# EAGLE design stk681ユニバーサル (EAGLE 5.11)
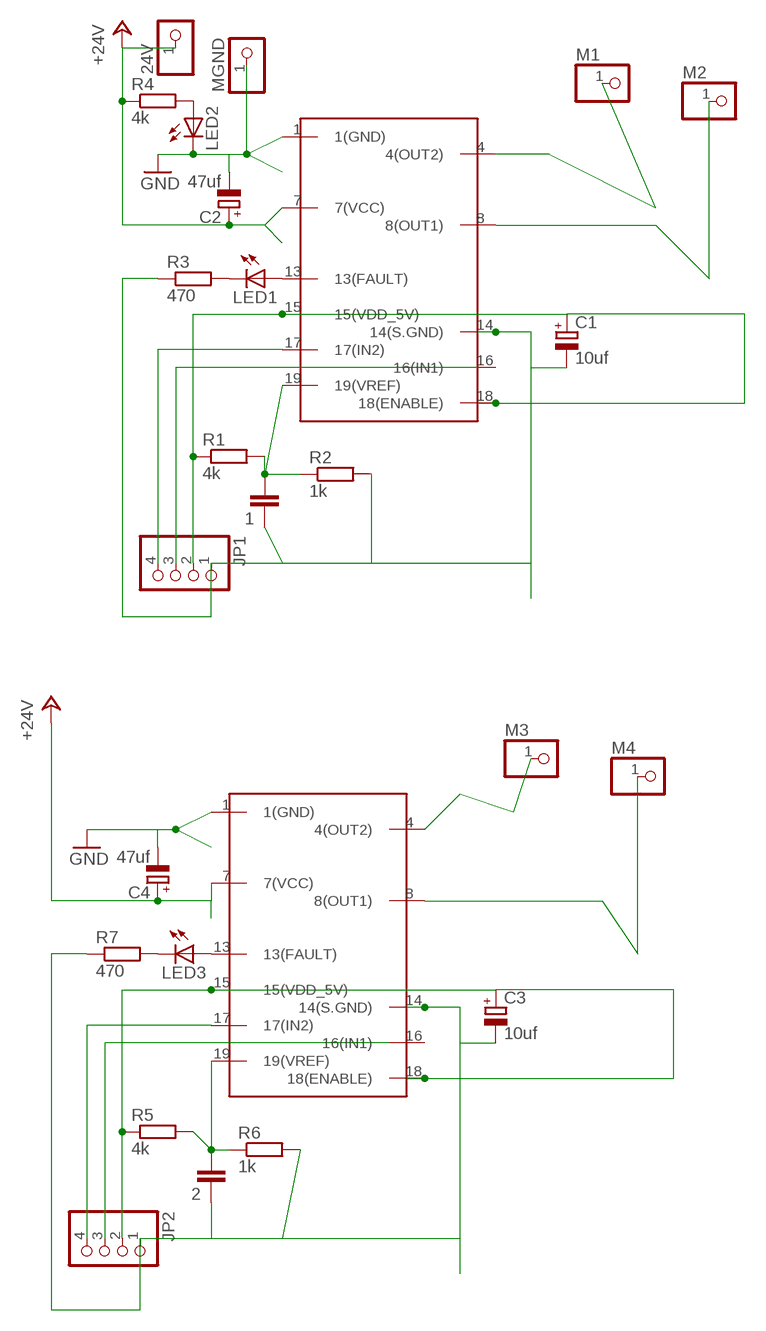
[diagram p0: schematic, sheet 1]

## Parts
1  C2,5-3  [C2.5-3]
2  C2,5-3  [C2.5-3]
24V  PINHD-1X1  [1X01]
C1  10uf  CPOL-EUSANYO_F13  [SANYO-OSCON_F13]
C2  47uf  CPOL-EUSANYO_F13  [SANYO-OSCON_F13]
C3  10uf  CPOL-EUSANYO_F13  [SANYO-OSCON_F13]
C4  47uf  CPOL-EUSANYO_F13  [SANYO-OSCON_F13]
JP1  PINHD-1X4/90  [1X04/90]
JP2  PINHD-1X4/90  [1X04/90]
LED1  LED5MM  [LED5MM]
LED2  LED5MM  [LED5MM]
LED3  LED5MM  [LED5MM]
M1  PINHD-1X1  [1X01]
M2  PINHD-1X1  [1X01]
M3  PINHD-1X1  [1X01]
M4  PINHD-1X1  [1X01]
MGND  PINHD-1X1  [1X01]
R1  4k  R-EU_0204/7  [0204/7]
R2  1k  R-EU_0204/7  [0204/7]
R3  470  R-EU_0204/7  [0204/7]
R4  4k  R-EU_0204/7  [0204/7]
R5  4k  R-EU_0204/7  [0204/7]
R6  1k  R-EU_0204/7  [0204/7]
R7  470  R-EU_0204/7  [0204/7]
U$1  STK-681-332_UNI  [STK681-332_UNI]
U$2  STK-681-332_UNI  [STK681-332_UNI]

## Nets
+24V: 24V.1 C2.+ C4.+ R4.1 U$1.7(7(VCC)) U$2.7(7(VCC))
GND: C2.- C4.- LED2.K(C) MGND.1 U$1.1(1(GND)) U$2.1(1(GND))
M1: M4.1
M2: M2.1
N$1: M1.1
N$2: M3.1
N$3: JP1.3
N$4: JP1.4 U$1.17(17(IN2))
N$5: LED1.A U$1.13(13(FAULT))
N$6: 1.2 R1.2 R2.1 U$1.19(19(VREF))
N$7: LED1.K(C) R3.2
N$8: LED3.A U$2.13(13(FAULT))
N$9: JP2.3
N$10: LED2.A R4.2
N$11: JP2.4 U$2.17(17(IN2))
N$13: 2.2 R5.2 R6.1 U$2.19(19(VREF))
N$14: LED3.K(C) R7.2
N$16: C3.+ JP2.2 R5.1 U$2.15(15(VDD_5V)) U$2.18(18(ENABLE))
N$17: C1.+ JP1.2 R1.1 U$1.15(15(VDD_5V)) U$1.18(18(ENABLE))
N$20: 2.1 C3.- JP2.1 R6.2 R7.1 U$2.14(14(S.GND))
N$21: 1.1 C1.- JP1.1 R2.2 R3.1 U$1.14(14(S.GND))
Unconnected: U$1.4(4(OUT2)) U$1.8(8(OUT1)) U$1.16(16(IN1)) U$2.4(4(OUT2)) U$2.8(8(OUT1)) U$2.16(16(IN1))

## Library data of the parts
1 2 = capacitor-wima:C: CAPACITOR naming: grid - package width
24V M1-M4 MGND = pinhead:PINHD-1X1: PIN HEADER
C1-C4 = rcl:CPOL-EU: POLARIZED CAPACITOR, European symbol
JP1 JP2 = pinhead:PINHD-1X4: PIN HEADER
LED1-LED3 = led:LED: LED OSRAM: - CHIPLED LG R971, LG N971, LY N971, LG Q971, LY Q971, LO R971, LY R971 LH N974, LH R974 LS Q976, LO Q976, LY Q976 LO Q996 - Hyper CHIPLED LW Q18S LB Q993, LB Q99A, LB R99A - SideLED LS A670, LO A670, LY A670, LG A670, LP A670 LB A673, LV A673, LT A673, LW A673 LH A674 LY A675 LS A676, LA A676, LO A676, LY A676, LW A676 LS A679, LY A679, LG A679 - Hyper Micro SIDELED® LS Y876, LA Y876, LO Y876, LY Y876 LT Y87S - SmartLED LW L88C, LW L88S LB L89C, LB L89S, LG L890 LS L89K, LO L89K, LY L89K LS L896, LA L896, LO L896, LY L896 - TOPLED LS T670, LO T670, LY T670, LG T670, LP T670 LSG T670, LSP T670, LSY T670, LOP T670, LYG T670 LG T671, LOG T671, LSG T671 LB T673, LV T673, LT T673, LW T673 LH T674 LS T676, LA T676, LO T676, LY T676, LB T676, LH T676, LSB T676, LW T676 LB T67C, LV T67C, LT T67C, LS T67K, LO T67K, LY T67K, LW E67C LS E67B, LA E67B, LO E67B, LY E67B, LB E67C, LV E67C, LT E67C LW T67C LS T679, LY T679, LG T679 LS T770, LO T770, LY T770, LG T770, LP T770 LB T773, LV T773, LT T773, LW T773 LH T774 LS E675, LA E675, LY E675, LS T675 LS T776, LA T776, LO T776, LY T776, LB T776 LHGB T686 LT T68C, LB T68C - Hyper Mini TOPLED® LB M676 - Mini TOPLED Santana® LG M470 LS M47K, LO M47K, LY M47K Source: http://www.osram.convergy.de LUXEON: - LUMILED® LXK2-PW12-R00, LXK2-PW12-S00, LXK2-PW14-U00, LXK2-PW14-V00 LXK2-PM12-R00, LXK2-PM12-S00, LXK2-PM14-U00 LXK2-PE12-Q00, LXK2-PE12-R00, LXK2-PE12-S00, LXK2-PE14-T00, LXK2-PE14-U00 LXK2-PB12-K00, LXK2-PB12-L00, LXK2-PB12-M00, LXK2-PB14-N00, LXK2-PB14-P00, LXK2-PB14-Q00 LXK2-PR12-L00, LXK2-PR12-M00, LXK2-PR14-Q00, LXK2-PR14-R00 LXK2-PD12-Q00, LXK2-PD12-R00, LXK2-PD12-S00 LXK2-PH12-R00, LXK2-PH12-S00 LXK2-PL12-P00, LXK2-PL12-Q00, LXK2-PL12-R00 Source: www.luxeon.com KINGBRIGHT: KA-3528ASYC Source: www.kingbright.com
R1-R7 = resistor:R-EU_: RESISTOR, European symbol
U$1 U$2 = STK-681-332-uni:STK-681-332_UNI: STK681-332 universal version

## Board
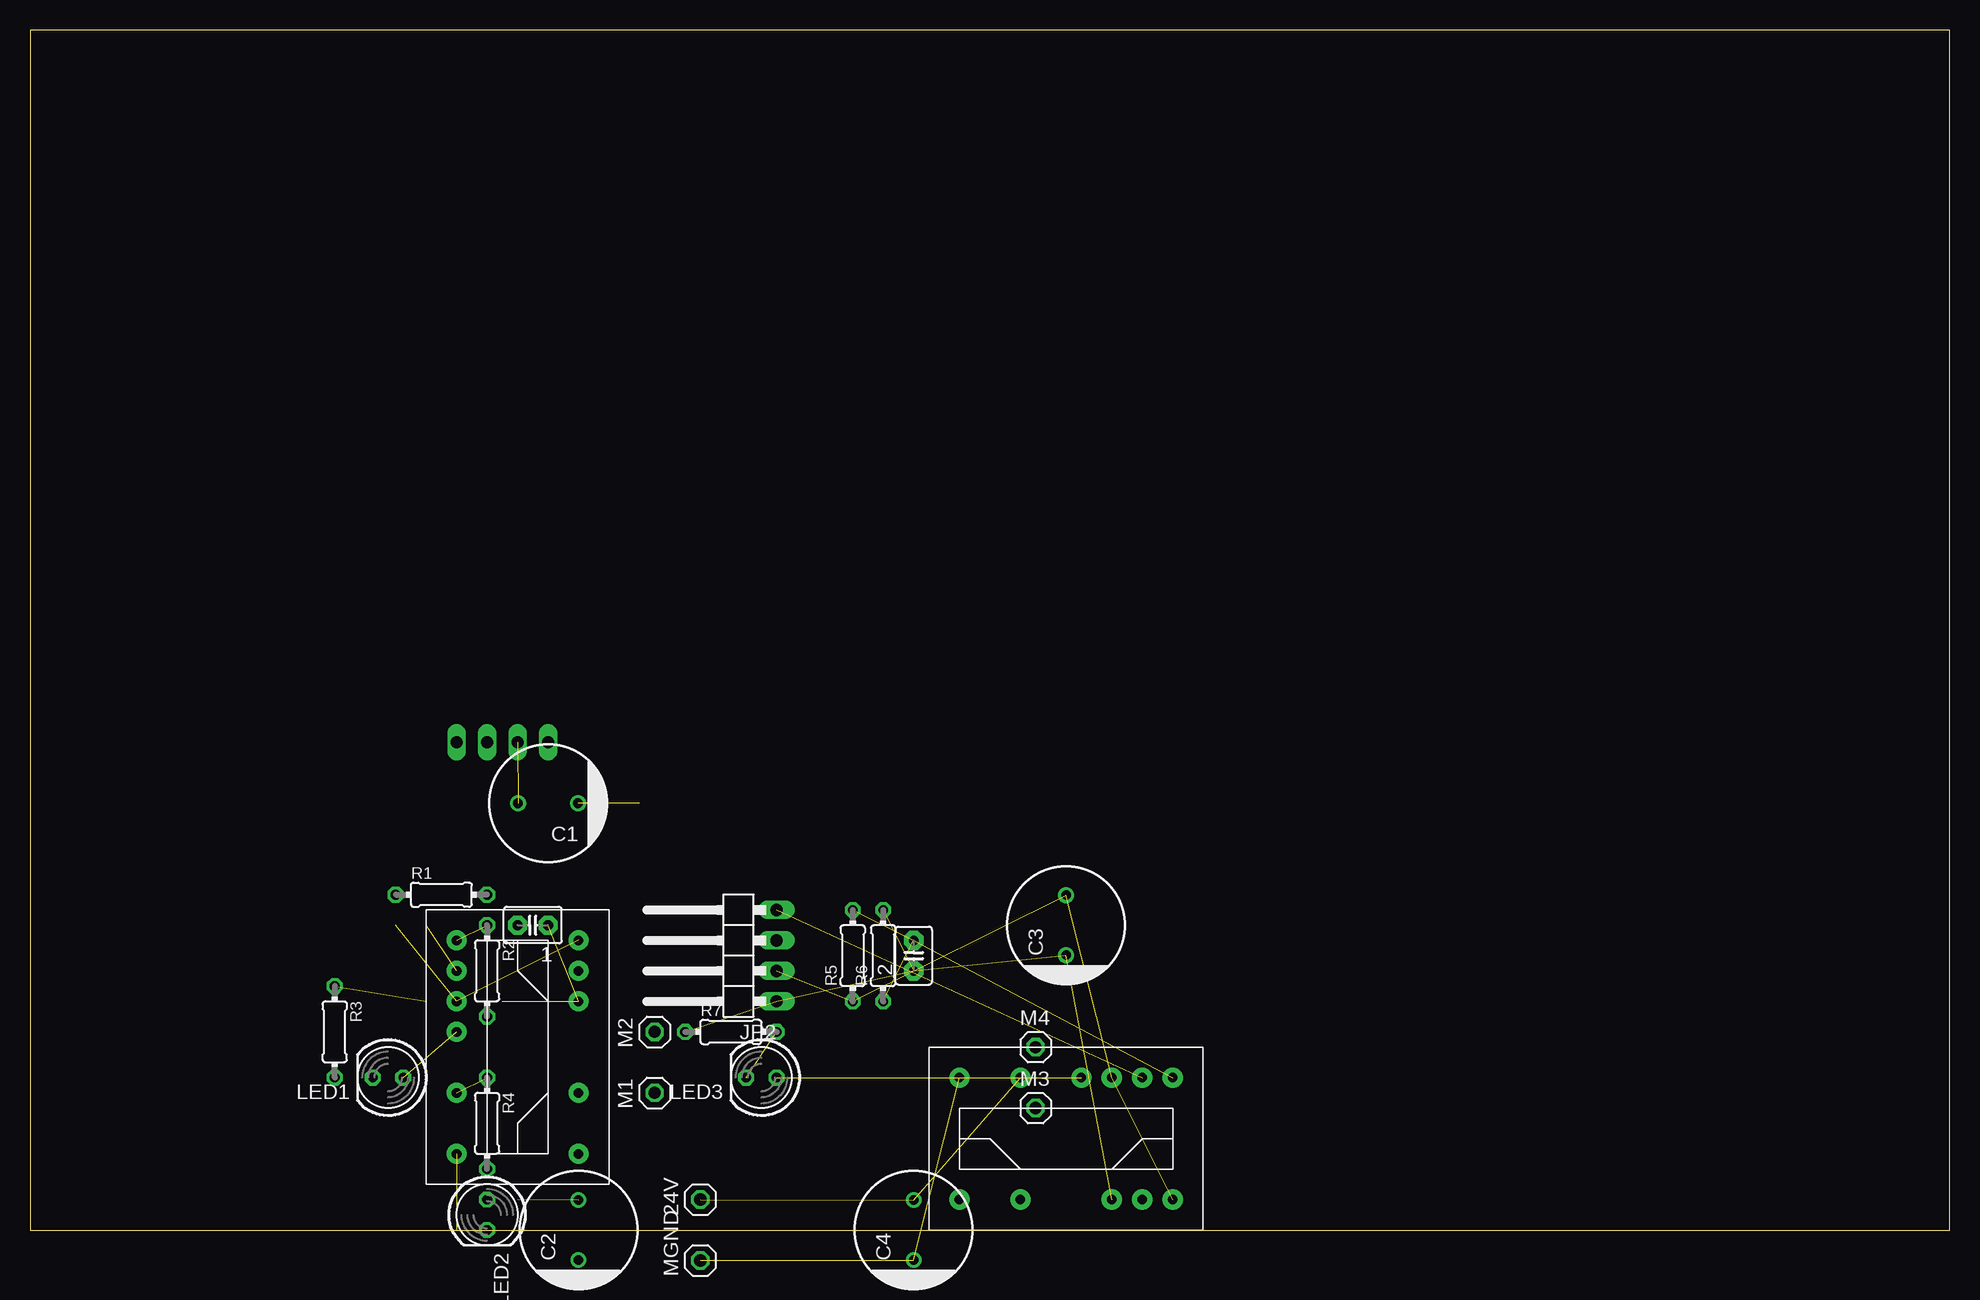
[diagram p1: board, top side]
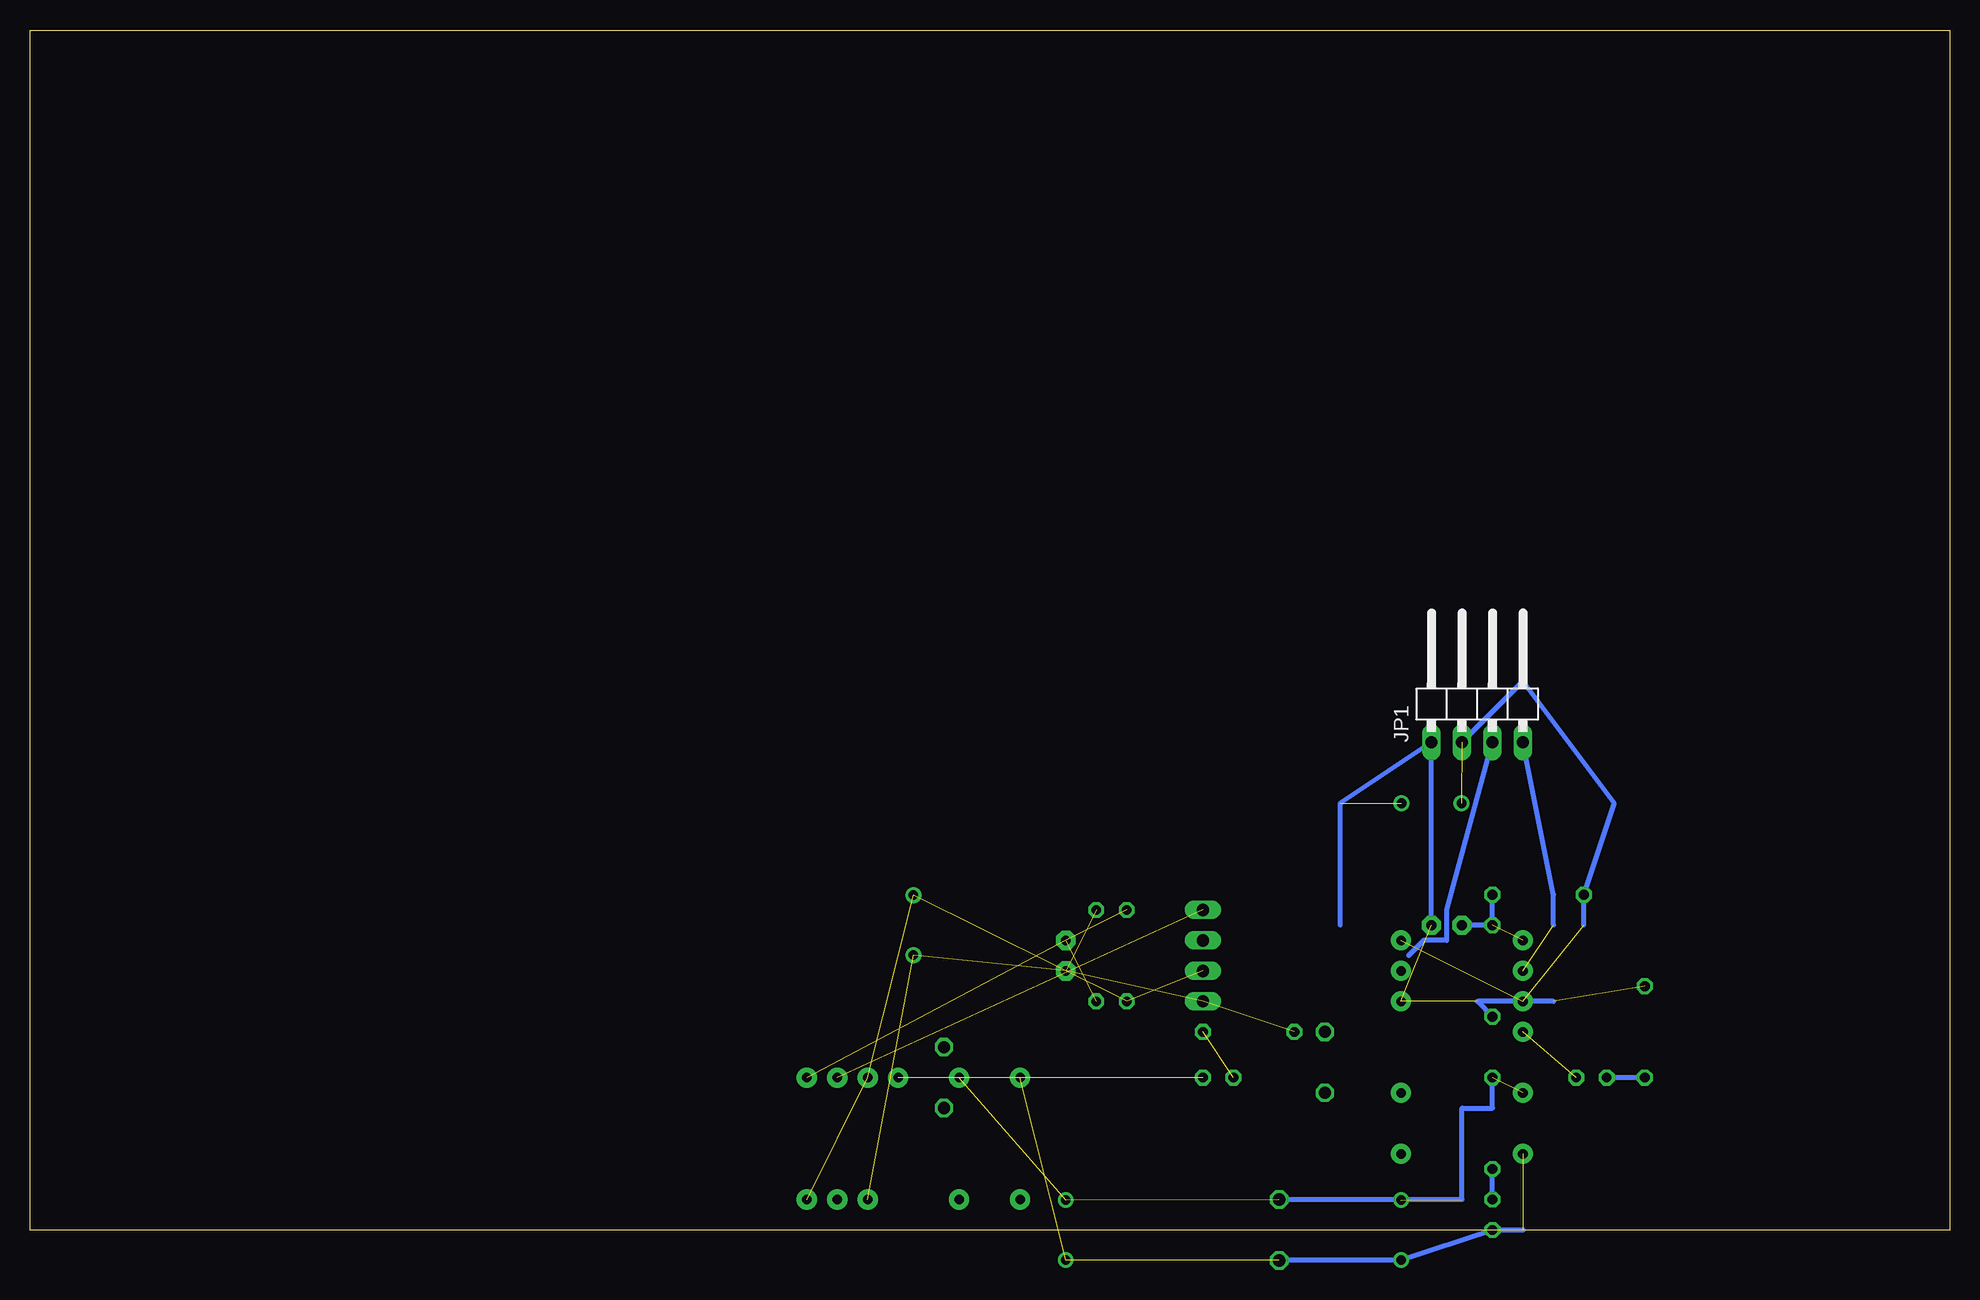
[diagram p2: board, bottom side, seen from below]

Size 160 x 100 mm. Coordinates in mm from the lower left corner, seen from the top.
Outline: 0,0 160,0 160,100 0,100 0,0
Copper layers (1*16): Top 0.035mm / dielectric 1.5mm / Bottom 0.035mm
Design rules "default": minimum track width 10mil, minimum drill 24mil, track to track 8mil, track to pad 8mil, pad to pad 8mil, via to via 8mil, smd to smd 8mil, copper to edge 40mil, drill to drill 8mil, minimum pad ring 10mil, minimum via ring 8mil, stop-mask expansion 4mil, vias tented up to drill 0mil, thermal gap 10mil

### Footprints (pad centres in the part's own frame; a part is rotated, then mirrored left to right if it is on the bottom)
C2.5-3 = drill 0.813 pad 1.6 octagon: 1 -1.27,0; 2 1.27,0
1X01 = drill 1.016 octagon: 1 0,0
SANYO-OSCON_F13 = drill 0.8 pad 1.27 round: + 2.5,0; - -2.5,0
1X04/90 = drill 1.016 long: 1 -3.81,-3.81; 2 -1.27,-3.81; 3 1.27,-3.81; 4 3.81,-3.81
LED5MM = drill 0.813 octagon: A -1.27,0; K 1.27,0
0204/7 = drill 0.813 octagon: 1 -3.81,0; 2 3.81,0
STK681-332_UNI = drill 0.8 pad 1.676 round: 1 -8.89,5.08; 4 -8.89,-5.08; 7 -3.81,5.08; 8 -3.81,-5.08; 13 1.27,5.08; 14 3.81,-5.08; 15 3.81,5.08; 16 6.35,-5.08; 17 6.35,5.08; 18 8.89,-5.08; 19 8.89,5.08

### Placement (x,y rotation side)
1  41.91,25.4 180 top
2  73.66,22.86 90 top
24V  55.88,2.54 90 top
C1  43.18,35.56 180 top
C2  45.72,0 90 top
C3  86.36,25.4 90 top
C4  73.66,0 90 top
JP1  39.37,44.45 0 bottom
JP2  58.42,22.86 90 top
LED1  29.84,12.7 180 top
LED2  38.1,1.27 270 top
LED3  60.96,12.7 180 top
M1  52.07,11.43 90 top
M2  52.07,16.51 90 top
M3  83.82,10.16 0 top
M4  83.82,15.24 0 top
MGND  55.88,-2.54 90 top
R1  34.29,27.94 0 top
R2  38.1,21.59 270 top
R3  25.4,16.51 270 top
R4  38.1,8.89 270 top
R5  68.58,22.86 90 top
R6  71.12,22.86 90 top
R7  58.42,16.51 0 top
U$1  40.64,15.24 90 top
U$2  86.36,7.62 0 top

### Tracks (layer width: path | path; a pad name or v marks a point on that pad's centre or on a via)
+24V  (4 unrouted)
  Bottom 0.406: R4.1 38.1,10.16 40.64,10.16 40.64,2.54 24V.1
GND  (3 unrouted)
  Bottom 0.406: 35.56,0 LED2.K C2.- MGND.1
N$3
  Bottom 0.406: JP1.3 41.91,26.67 41.91,24.13 43.81,24.13 45.09,22.86
N$4  (1 unrouted)
  Bottom 0.406: 33.02,25.4 33.02,27.94 JP1.4
N$5  (1 unrouted)
N$6  (1 unrouted)
  Bottom 0.406: R1.2 R2.1 1.2
N$7
  Bottom 0.406: R3.2 LED1.K
N$8  (1 unrouted)
N$10
  Bottom 0.406: LED2.A R4.2
N$11  (1 unrouted)
N$13  (3 unrouted)
N$14  (1 unrouted)
N$16  (4 unrouted)
N$17  (3 unrouted)
  Bottom 0.406: JP1.2 35.56,45.72 27.94,35.56 R1.1 30.48,25.4
N$20  (5 unrouted)
N$21  (4 unrouted)
  Bottom 0.406: R2.2 39.37,19.05 33.02,19.05 | 1.1 JP1.1 50.8,35.56 50.8,25.4